# EasyEDA schematic Schematic_RocketTalk 4.6_2021-07-23.json
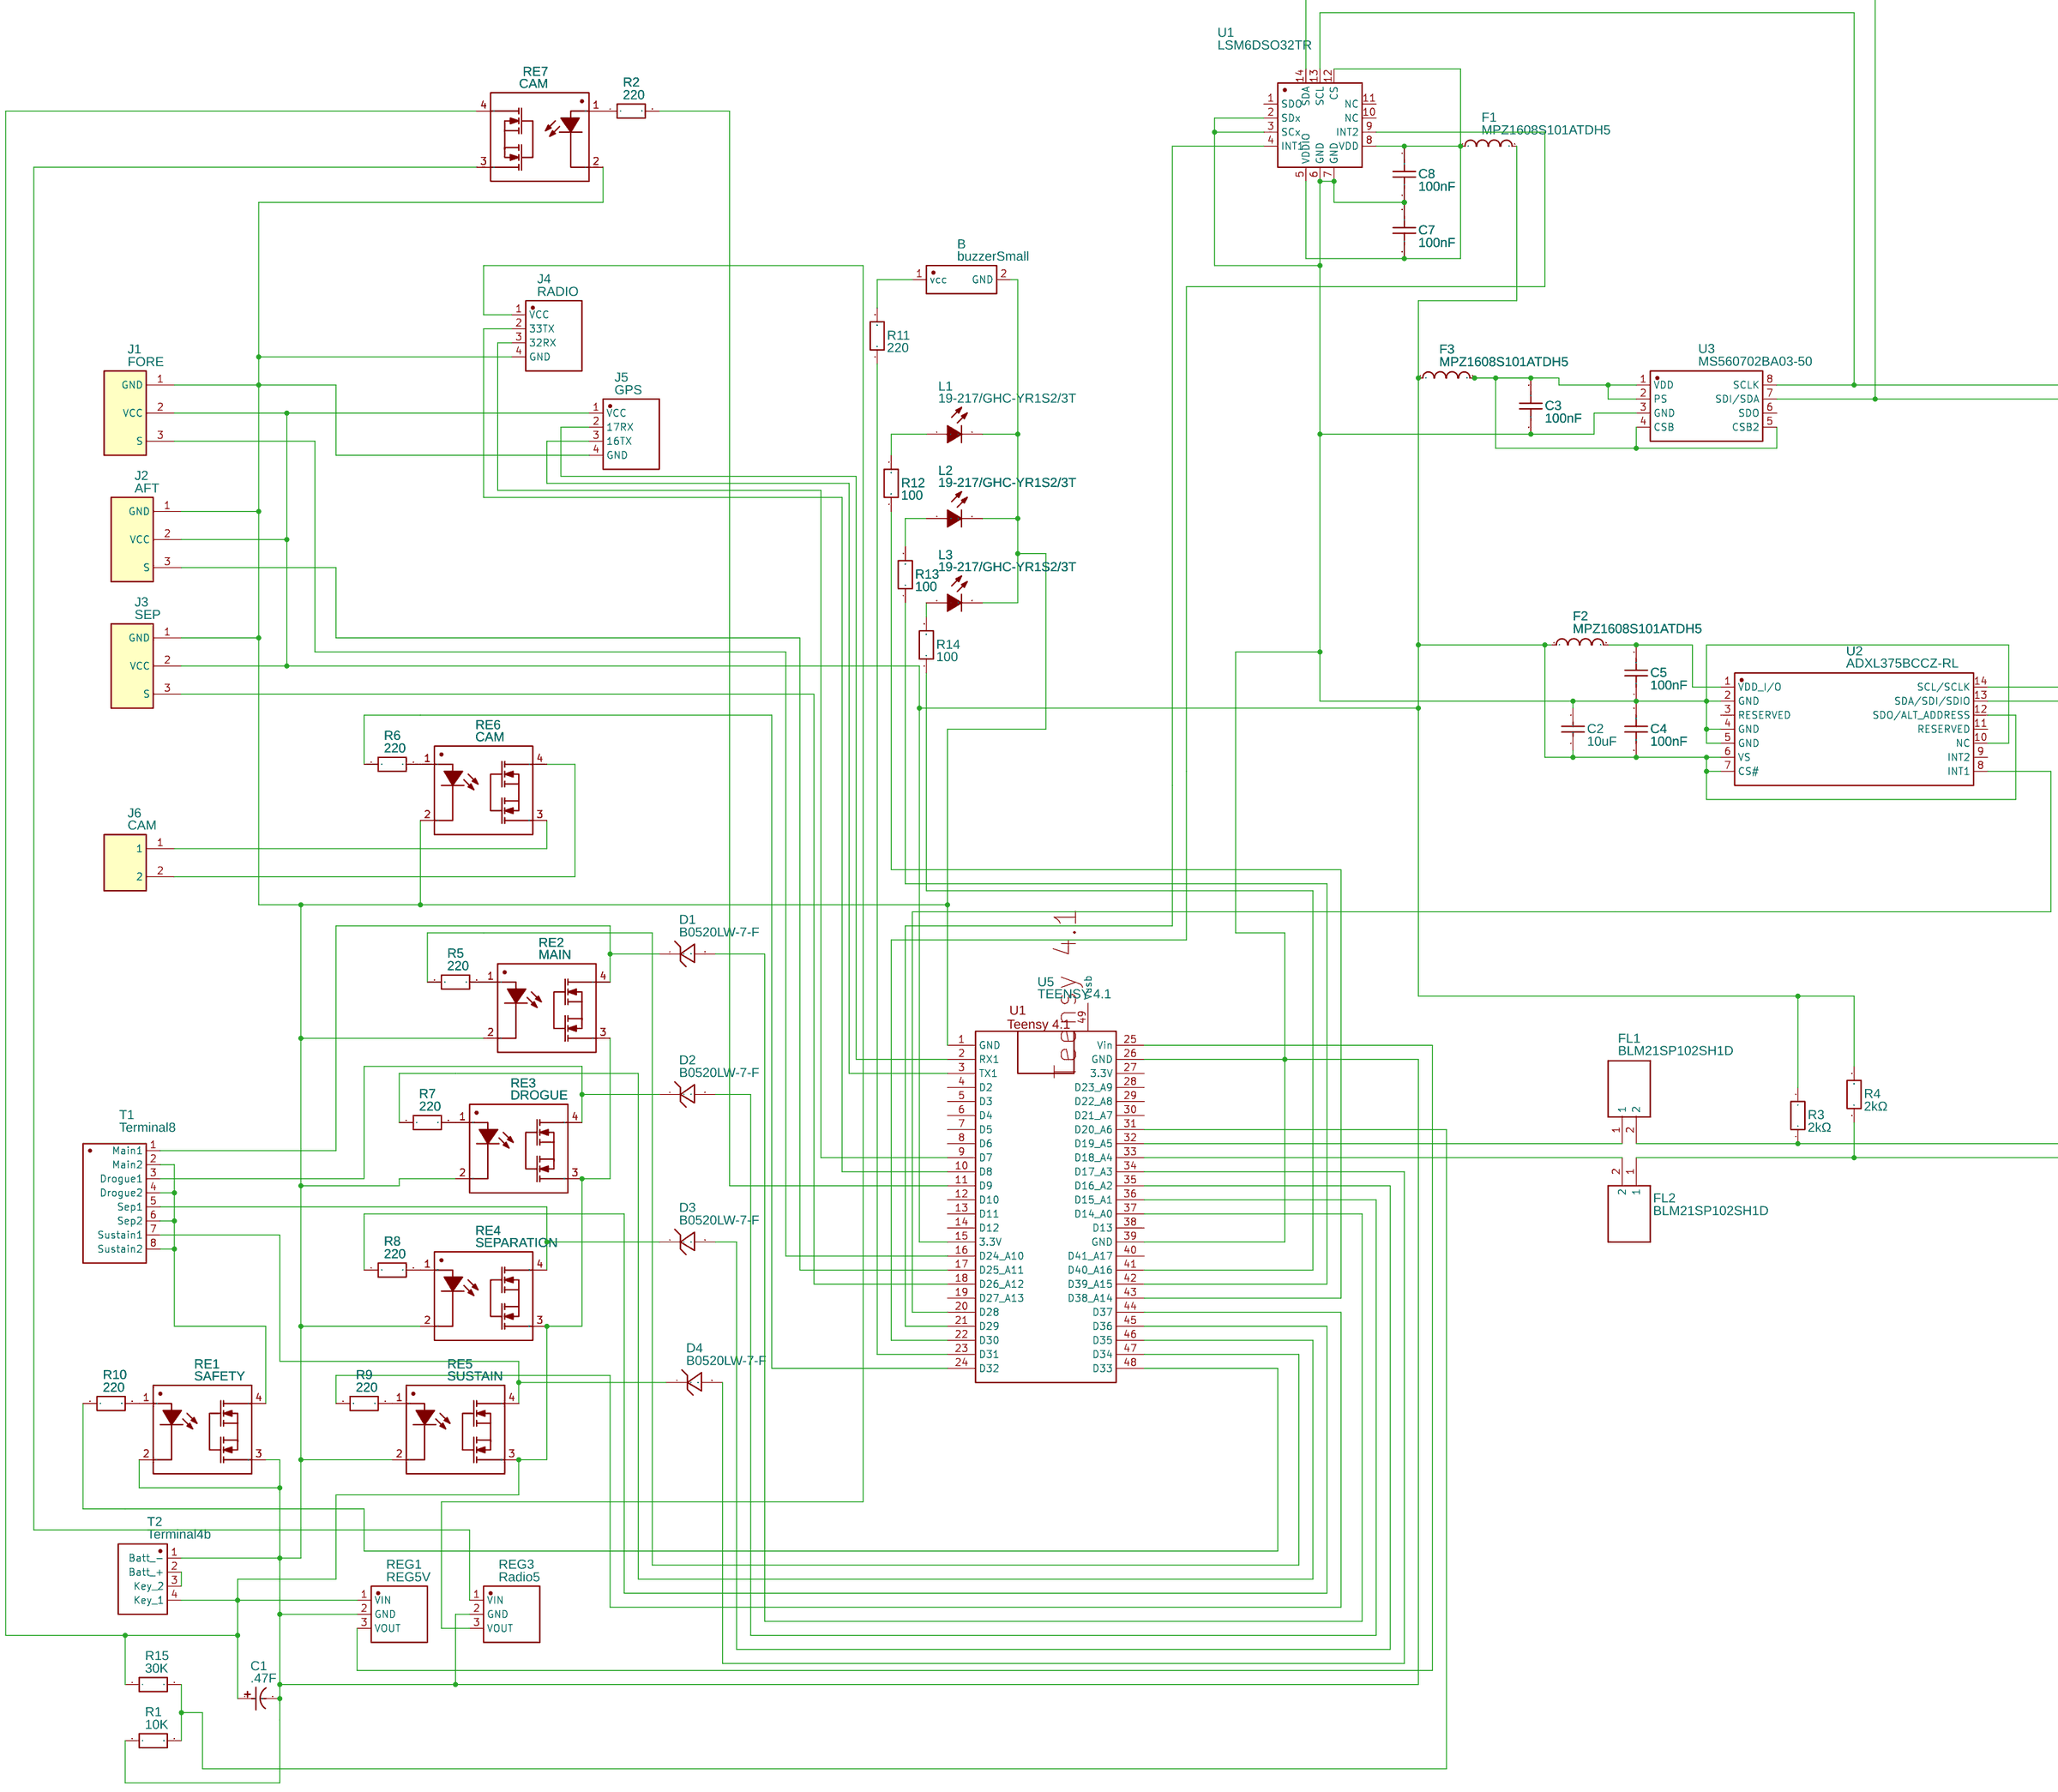
[diagram p0: schematic sheet]

## Parts
B  buzzerSmall  [BUZZERSMALL]
C1  .47F  [SUPERCAP33]
C2  10uF  [C0402]
C3  100nF  [C0402]
C4  100nF  [C0402]
C5  100nF  [C0402]
C7  100nF  [C0402]
C8  100nF  [C0402]
D1  B0520LW-7-F  [SOD-123FL_L2.7-W1.8-LS3.8-RD]
D2  B0520LW-7-F  [SOD-123FL_L2.7-W1.8-LS3.8-RD]
D3  B0520LW-7-F  [SOD-123FL_L2.7-W1.8-LS3.8-RD]
D4  B0520LW-7-F  [SOD-123FL_L2.7-W1.8-LS3.8-RD]
F1  MPZ1608S101ATDH5  [L0603]
F2  MPZ1608S101ATDH5  [L0603]
F3  MPZ1608S101ATDH5  [L0603]
FL1  BLM21SP102SH1D  [BLM21AG102BH1J]
FL2  BLM21SP102SH1D  [BLM21AG102BH1J]
J1  FORE  [PH-3A]
J2  AFT  [PH-3A]
J3  SEP  [PH-3A]
J4  RADIO  [B4B-PH-K(LF)(SN)]
J5  GPS  [B4B-PH-K(LF)(SN)]
J6  CAM  [CONN-TH_B2B-PH-K-S]
L1  19-217/GHC-YR1S2/3T  [LED0603-R-RD]
L2  19-217/GHC-YR1S2/3T  [LED0603-R-RD]
L3  19-217/GHC-YR1S2/3T  [LED0603-R-RD]
R1  10K  [R0805]
R2  220  [R0805]
R3  2kΩ  [R0805]
R4  2kΩ  [R0805]
R5  220  [R0805]
R6  220  [R0805]
R7  220  [R0805]
R8  220  [R0805]
R9  220  [R0805]
R10  220  [R0805]
R11  220  [R0805]
R12  100  [R0805]
R13  100  [R0805]
R14  100  [R0805]
R15  30K  [R0805]
RE1  SAFETY  [DIP-4_L6.4-W4.6-P2.54-LS7.6-BL]
RE2  MAIN  [DIP-4_L6.4-W4.6-P2.54-LS7.6-BL]
RE3  DROGUE  [DIP-4_L6.4-W4.6-P2.54-LS7.6-BL]
RE4  SEPARATION  [DIP-4_L6.4-W4.6-P2.54-LS7.6-BL]
RE5  SUSTAIN  [DIP-4_L6.4-W4.6-P2.54-LS7.6-BL]
RE6  CAM  [DIP-4_L6.4-W4.6-P2.54-LS7.6-BL]
RE7  CAM  [DIP-4_L6.4-W4.6-P2.54-LS7.6-BL]
REG1  REG5V  [REG5FOOT]
REG3  Radio5  [REG5FOOT]
T1  Terminal8  [TERMINAL8]
T2  Terminal4b  [TERMINAL4B]
U1  LSM6DSO32TR  [LGA-14L-MB]
U2  ADXL375BCCZ-RL  [LGA-14_L5.0-W3.0-P0.80-BL]
U3  MS560702BA03-50  [SENSOR-SMD_MS560702BA03-50]
U5  TEENSY 4.1  [TEENSY 4.1]

## Library data of the parts
B = buzzerSmall: Contributor: mbrinker
C1 = SP-5R5-Z224VYA: Supplier: LCSC; Manufacturer: KAMCAP; Supplier Part: C128280
C2 = CL05A106MQ5NUNC: Supplier: LCSC; Manufacturer: SAMSUNG; Supplier Part: C15525; SMT Type: Basic; JLCPCB SMD: Yes; LCSC Assembly: Yes; Paste Type: base
C3-C5 C7 C8 = CC0402KRX7R6BB104: Supplier: LCSC; Supplier Part: C309458; Manufacturer: YAGEO; Contributor: LCSC; SMT Type: Extend; JLCPCB SMD: Yes; LCSC Assembly: Yes; Paste Type: expand
D1-D4 = B0520LW-7-F: Supplier: LCSC; Supplier Part: C155367; Manufacturer: Diodes Incorporated; Contributor: LCSC; SMT Type: Extend; JLCPCB SMD: Yes; LCSC Assembly: Yes; Paste Type: expand
F1-F3 = MPZ1608S101ATDH5: Supplier: LCSC; Supplier Part: C307769; Manufacturer: TDK; Contributor: LCSC
FL1 FL2 = BLM21SP102SH1D: Contributor: Jonas_IM2M
J1-J3 = -: Supplier: LCSC; Manufacturer: JST; Manufacturer Part: B3B-PH-K-S(LF)(SN); Contributor: LCSC; Supplier Part: C131339
J4 J5 = -: Supplier: LCSC; Supplier Part: C265289; Manufacturer: JST Sales America; Contributor: LCSC
J6 = B2B-PH-K-S(LF)(SN): Supplier: LCSC; Manufacturer: JST; Contributor: LCSC; Supplier Part: C131337
L1-L3 = 19-217/GHC-YR1S2/3T: Supplier: LCSC; Manufacturer: EVERLIGHT; image: //image.lceda.cn/szlcsc/C72043.jpg; Supplier Part: C72043; SMT Type: Basic; JLCPCB SMD: Yes; LCSC Assembly: Yes; Paste Type: base
R1 R2 R5-R15 = ERJP06J221V: Supplier: LCSC; Supplier Part: C417010; Manufacturer: PANASONIC; Contributor: LCSC
R3 R4 = ERA6AEB202V: Supplier: LCSC; Supplier Part: C417117; Manufacturer: PANASONIC; Contributor: LCSC
RE1-RE7 = AQY210EH: Supplier: LCSC; Manufacturer: PANASONIC; Supplier Part: C13541
REG1 REG3 = -: Contributor: mbrinker
T1 = Terminal8: Contributor: mbrinker
T2 = Terminal4b: Contributor: mbrinker
U1 = LSM6DSO32TR: Manufacturer: STMicroelectronics; Supplier: Digi-Key; Supplier Part: 497-LSM6DSO32TR-ND; link: https://www.st.com/en/mems-and-sensors/lsm6dso32.html#resource; Contributor: joar.gjersund
U2 = ADXL375BCCZ-RL: Supplier: LCSC; Supplier Part: C662206; Manufacturer: Analog Devices; Contributor: LCSC
U3 = MS560702BA03-50: Supplier: LCSC; Supplier Part: C97627; Manufacturer: TE Connectivity; Contributor: LCSC
U5 = TEENSY 4.1: Contributor: cagoldwater

## Nets
Net-(B-1): B.1(vcc) R11.2
Net-(B-2): B.2(GND) C1.2 C2.1 C3.1 C4.1 C5.1 C7.1 C8.2 J1.1(GND) J2.1(GND) J3.1(GND) J4.4(GND) J5.4(GND) L1.2(C) L2.2(C) L3.2(C) R1.1 RE1.2(K) RE1.3 RE2.2(K) RE3.2(K) RE4.2(K) RE5.2(K) RE6.2(K) RE7.2(K) REG1.2(GND) REG3.2(GND) T2.1(Batt -) U1.2(SDx) U1.3(SCx) U1.6(GND) U1.7(GND) U2.2(GND) U2.4(GND) U2.5(GND) U2.10(NC) U3.3(GND) U5.1(GND) U5.26(GND) U5.39(GND)
Net-(C1-1): C1.1 R15.1 RE2.3 RE3.3 RE4.3 RE5.3 RE7.4 REG1.1(VIN) T2.4(Key 1)
Net-(C2-2): C2.2 C4.2 F1.2 F2.1 F3.1 J1.2(VCC) J2.2(VCC) J3.2(VCC) J5.1(VCC) R3.2 R4.2 U2.6(VS) U2.7(CS#) U2.12(SDO/ALT ADDRESS) U5.15(3.3V)
Net-(C3-2): C3.2 F3.2 U3.1(VDD) U3.2(PS) U3.4(CSB) U3.5(CSB2)
Net-(C5-2): C5.2 F2.2 U2.1(VDD I/O)
Net-(C7-2): C7.2 C8.1 F1.1 U1.5(VDDIO) U1.8(VDD) U1.12(CS)
Net-(D1-1): D1.1 RE2.4 T1.1(Main1)
Net-(D1-2): D1.2 U5.37(D14 A0)
Net-(D2-1): D2.1 RE3.4 T1.3(Drogue1)
Net-(D2-2): D2.2 U5.36(D15 A1)
Net-(D3-1): D3.1 RE4.4 T1.5(Sep1)
Net-(D3-2): D3.2 U5.35(D16 A2)
Net-(D4-1): D4.1 RE5.4 T1.7(Sustain1)
Net-(D4-2): D4.2 U5.34(D17 A3)
Net-(FL1-1): FL1.1 U5.32(D19 A5)
Net-(FL1-2): FL1.2 R3.1 U1.13(SCL) U2.14(SCL/SCLK) U3.8(SCLK)
Net-(FL2-1): FL2.1 R4.1 U1.14(SDA) U2.13(SDA/SDI/SDIO) U3.7(SDI/SDA)
Net-(FL2-2): FL2.2 U5.33(D18 A4)
Net-(J1-3): J1.3(S) U5.16(D24 A10)
Net-(J2-3): J2.3(S) U5.17(D25 A11)
Net-(J3-3): J3.3(S) U5.18(D26 A12)
Net-(J4-1): J4.1(VCC) REG3.3(VOUT)
Net-(J4-2): J4.2(33TX) U5.10(D8)
Net-(J4-3): J4.3(32RX) U5.9(D7)
Net-(J5-2): J5.2(17RX) U5.2(RX1)
Net-(J5-3): J5.3(16TX) U5.3(TX1)
Net-(J6-1): J6.1 RE6.3
Net-(J6-2): J6.2 RE6.4
Net-(L1-1): L1.1(A) R12.2
Net-(L2-1): L2.1(A) R13.2
Net-(L3-1): L3.1(A) R14.2
Net-(R1-2): R1.2 R15.2 U5.31(D20 A6)
Net-(R2-1): R2.1 RE7.1
Net-(R2-2): R2.2 U5.11(D9)
Net-(R5-1): R5.1 U5.47(D34)
Net-(R5-2): R5.2 RE2.1
Net-(R6-1): R6.1 U5.24(D32)
Net-(R6-2): R6.2 RE6.1
Net-(R7-1): R7.1 U5.46(D35)
Net-(R7-2): R7.2 RE3.1
Net-(R8-1): R8.1 U5.45(D36)
Net-(R8-2): R8.2 RE4.1
Net-(R9-1): R9.1 U5.44(D37)
Net-(R9-2): R9.2 RE5.1
Net-(R10-1): R10.1 U5.48(D33)
Net-(R10-2): R10.2 RE1.1
Net-(R11-1): R11.1 U5.23(D31)
Net-(R12-1): R12.1 U5.43(D38 A14)
Net-(R13-1): R13.1 U5.42(D39 A15)
Net-(R14-1): R14.1 U5.41(D40 A16)
Net-(RE1-4): RE1.4 T1.2(Main2) T1.4(Drogue2) T1.6(Sep2) T1.8(Sustain2)
Net-(RE7-3): RE7.3 REG3.1(VIN)
Net-(REG1-3): REG1.3(VOUT) U5.25(Vin)
Net-(T2-2): T2.2(Batt +) T2.3(Key 2)
Net-(U1-4): U1.4(INT1) U5.21(D29)
Net-(U1-9): U1.9(INT2) U5.22(D30)
Net-(U2-8): U2.8(INT1) U5.20(D28)

Not connected (* = marked no-connect by the designer): U1 1(SDO) 10(NC) 11(NC); U2 3(RESERVED) 9(INT2) 11(RESERVED); U3 6(SDO); U5 4(D2) 5(D3) 6(D4) 7(D5) 8(D6) 12(D10) 13(D11) 14(D12) 19(D27 A13) 27(3.3V) 28(D23 A9) 29(D22 A8) 30(D21 A7) 38(D13) 40(D41 A17) 49(Vusb)
